# Altium project PONG.PrjPcb
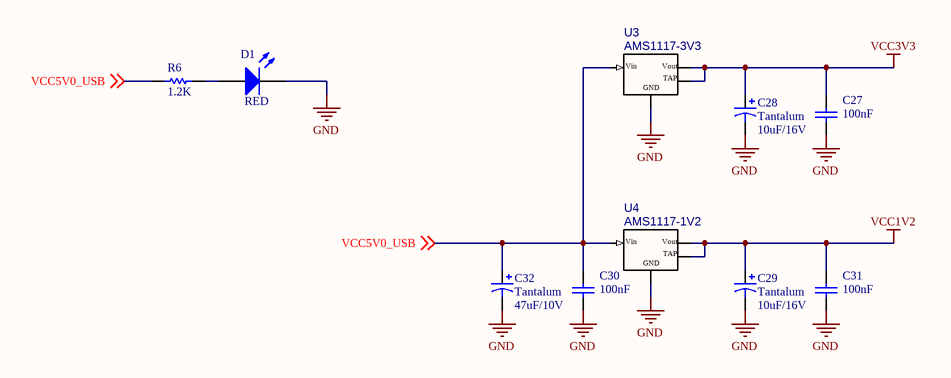
[diagram p0: s1.SchDoc]
3 sheets, 80 parts. Net scope: global (net labels, ports and power ports of the same name join across sheets).
Board file: pcb.PcbDoc
Sheets:
  s1.SchDoc
  s2.SchDoc
  s4.SchDoc

## Sheet s1.SchDoc
size A

### Parts
C27  value 100nF  [0805 CAP]  (hidden comment: Cap)
C28  Tantalum  value 10uF/16V  [CT1206_TANTALUM-SMD-10UF-20V-20%(1206)(Primary)]
C29  Tantalum  value 10uF/16V  [CT1206_TANTALUM-SMD-10UF-20V-20%(1206)(Primary)]
C30  value 100nF  [0805 CAP]  (hidden comment: Cap)
C31  value 100nF  [0805 CAP]  (hidden comment: Cap)
C32  Tantalum  value 47uF/10V  [CT1206_TANTALUM-SMD-10UF-20V-20%(1206)(Primary)]
D1  RED  [0805 LED]
R6  1.2K  [0805 RES]
U3  AMS1117-3V3  [AMS1117_AMS1117(Primary)]
U4  AMS1117-1V2  [AMS1117_AMS1117(Primary)]

### Nets
GND: C27.1 C28.2 C29.2 C30.1 C31.1 C32.2 D1.2(K) U3.GND(ADJ-GND) U4.GND(ADJ-GND)  [project net FPGA_M1]
VCC1V2: C29.1 C31.2 U4.HEATSINK U4.VOUT
VCC3V3: C27.2 C28.1 U3.HEATSINK U3.VOUT  [project net FPGA_M0]
VCC5V0_USB: C30.2 C32.1 R6.1 U3.VIN U4.VIN ; off-sheet VCC5V0_USB
NetD1_1: D1.1(A) R6.2

### Notes on the sheet
- (in symbol AMS1117) Vin; Vout; TAP

### Library data of the parts
C27 C30 C31 = Cap: Capacitor; Published: 8-Jun-2000; LatestRevisionDate: 17-Jul-2002; LatestRevisionNote: Re-released for DXP Platform.; PackageReference: RAD-0.3; Publisher: Altium Limited; PackageDescription: Radial Cap, Thru-Hole; 2 Leads; 0.3 in Pin Spacing
C28 C29 C32 = Cap Pol3: Polarized Capacitor (Surface Mount); Published: 8-Jun-2000; LatestRevisionDate: 29-May-2009; LatestRevisionNote: IPC-7351 Footprint Added.; PackageReference: C0805; Publisher: Altium Limited; PackageDescription: Chip Capacitor
D1 = LED0: Typical INFRARED GaAs LED; Published: 8-Jun-2000; LatestRevisionDate: 08-Jul-2005; LatestRevisionNote: Mech Layer 1 removed.; PackageReference: LED-0; Publisher: Altium Limited; PackageDescription: LED; 2 Leads
R6 = Res1: Resistor; Published: 8-Jun-2000; LatestRevisionDate: 17-Jul-2002; LatestRevisionNote: Re-released for DXP Platform.; PackageReference: AXIAL-0.3; Publisher: Altium Limited; PackageDescription: Axial Device, Thru-Hole; 2 Leads; 0.3 in Pin Spacing; Value: 1.2K
U3 U4 = AMS1117: Integrated Circuit; MF: Advanced Monolithic Systems; Package: UFQFN-24 Advanced Monolithic Systems; Availability: Unavailable; MP: AMS1117; Price: None; Value: *

## Sheet s2.SchDoc
size B
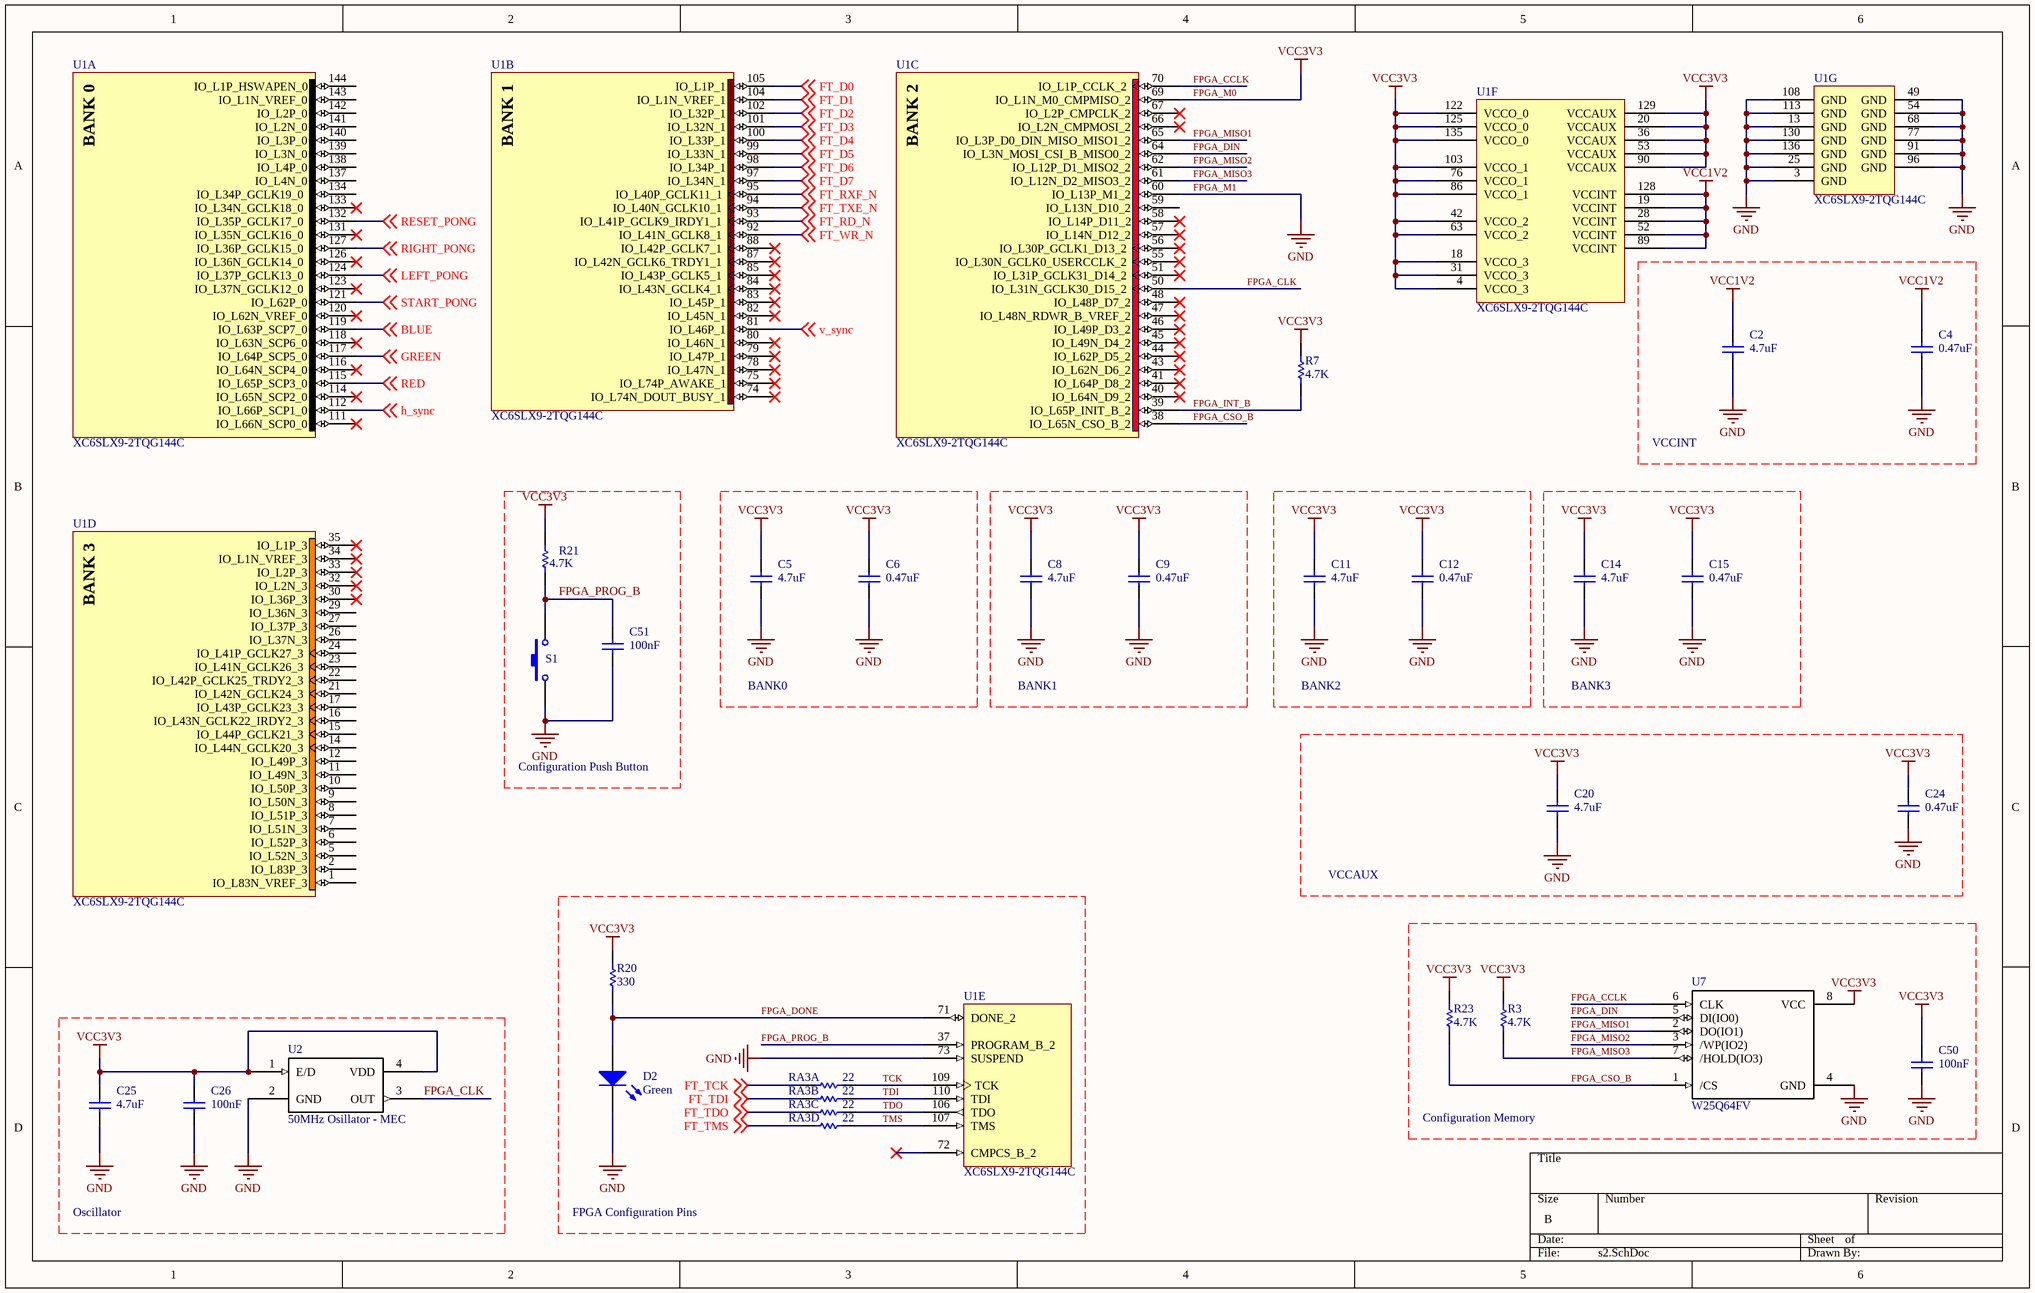
[diagram p1: s2.SchDoc]

### Parts
C2  value 4.7uF  [0805 CAP]  (hidden comment: Cap)
C4  value 0.47uF  [0805 CAP]  (hidden comment: Cap)
C5  value 4.7uF  [0805 CAP]  (hidden comment: Cap)
C6  value 0.47uF  [0805 CAP]  (hidden comment: Cap)
C8  value 4.7uF  [0805 CAP]  (hidden comment: Cap)
C9  value 0.47uF  [0805 CAP]  (hidden comment: Cap)
C11  value 4.7uF  [0805 CAP]  (hidden comment: Cap)
C12  value 0.47uF  [0805 CAP]  (hidden comment: Cap)
C14  value 4.7uF  [0805 CAP]  (hidden comment: Cap)
C15  value 0.47uF  [0805 CAP]  (hidden comment: Cap)
C20  value 4.7uF  [0805 CAP]  (hidden comment: Cap)
C24  value 0.47uF  [0805 CAP]  (hidden comment: Cap)
C25  value 4.7uF  [0805 CAP]  (hidden comment: Cap)
C26  value 100nF  [0805 CAP]  (hidden comment: Cap)
C50  value 100nF  [0805 CAP]  (hidden comment: Cap)
C51  value 100nF  [0805 CAP]  (hidden comment: Cap)
D2  Green  [0805 LED]
R3  value 4.7K  [0805 RES]  (hidden comment: Res1)
R7  value 4.7K  [0805 RES]  (hidden comment: Res1)
R20  value 330  [0805 RES]  (hidden comment: Res1)
R21  value 4.7K  [0805 RES]  (hidden comment: Res1)
R23  value 4.7K  [0805 RES]  (hidden comment: Res1)
RA3A  value 22  [0805 RES]  (hidden comment: Res1)
RA3B  value 22  [0805 RES]  (hidden comment: Res1)
RA3C  value 22  [0805 RES]  (hidden comment: Res1)
RA3D  value 22  [0805 RES]  (hidden comment: Res1)
S1  SW-PB  [Tack Switch]  (value not drawn)
U1  XC6SLX9-2TQG144C  [TQG144_M]  (parts A,B,C,D,E,F,G of 7)
U2  50MHz Osillator - MEC  [50MHz Osillator - MEC]
U7  W25Q64FV  [SO08 - duplicate]

### Nets
FPGA_M0: C5.2 C6.2 C8.2 C9.2 C11.2 C12.2 C14.2 C15.2 C20.2 C24.2 C25.2 C26.2 C50.2 R3.2 R7.2 R20.2 R21.2 R23.2 U1.4(VCCO_3) U1.18(VCCO_3) U1.20(VCCAUX) U1.31(VCCO_3) U1.36(VCCAUX) U1.42(VCCO_2) U1.53(VCCAUX) U1.63(VCCO_2) U1.69(IO_L1N_M0_CMPMISO_2) U1.76(VCCO_1) U1.86(VCCO_1) U1.90(VCCAUX) U1.103(VCCO_1) U1.122(VCCO_0) U1.125(VCCO_0) U1.129(VCCAUX) U1.135(VCCO_0) U2.1(E/D) U2.4(VDD) U7.8(VCC)  [also labelled VCC3V3]
FPGA_M1: C2.1 C4.1 C5.1 C6.1 C8.1 C9.1 C11.1 C12.1 C14.1 C15.1 C20.1 C24.1 C25.1 C26.1 C50.1 C51.1 D2.2(K) S1.1 U1.3(GND) U1.13(GND) U1.25(GND) U1.49(GND) U1.54(GND) U1.60(IO_L13P_M1_2) U1.68(GND) U1.73(SUSPEND) U1.77(GND) U1.91(GND) U1.96(GND) U1.108(GND) U1.113(GND) U1.130(GND) U1.136(GND) U2.2(GND) U7.4(GND)  [also labelled GND]
VCC1V2: C2.2 C4.2 U1.19(VCCINT) U1.28(VCCINT) U1.52(VCCINT) U1.89(VCCINT) U1.128(VCCINT)
BLUE: U1.119(IO_L63P_SCP7_0) ; off-sheet BLUE
FPGA_CCLK: U1.70(IO_L1P_CCLK_2) U7.6(CLK)
FPGA_CLK: U1.50(IO_L31N_GCLK30_D15_2) U2.3(OUT)
FPGA_CSO_B: R23.1 U1.38(IO_L65N_CSO_B_2) U7.1(/CS)
FPGA_DIN: U1.64(IO_L3N_MOSI_CSI_B_MISO0_2) U7.5(DI(IO0))
FPGA_DONE: D2.1(A) R20.1 U1.71(DONE_2)
FPGA_INT_B: R7.1 U1.39(IO_L65P_INIT_B_2)
FPGA_MISO1: U1.65(IO_L3P_D0_DIN_MISO_MISO1_2) U7.2(DO(IO1))
FPGA_MISO2: U1.62(IO_L12P_D1_MISO2_2) U7.3(/WP(IO2))
FPGA_MISO3: R3.1 U1.61(IO_L12N_D2_MISO3_2) U7.7(/HOLD(IO3))
FPGA_PROG_B: C51.2 R21.1 S1.2 U1.37(PROGRAM_B_2)
FT_D0: U1.105(IO_L1P_1) ; off-sheet FT_D0
FT_D1: U1.104(IO_L1N_VREF_1) ; off-sheet FT_D1
FT_D2: U1.102(IO_L32P_1) ; off-sheet FT_D2
FT_D3: U1.101(IO_L32N_1) ; off-sheet FT_D3
FT_D4: U1.100(IO_L33P_1) ; off-sheet FT_D4
FT_D5: U1.99(IO_L33N_1) ; off-sheet FT_D5
FT_D6: U1.98(IO_L34P_1) ; off-sheet FT_D6
FT_D7: U1.97(IO_L34N_1) ; off-sheet FT_D7
FT_RD_N: U1.93(IO_L41P_GCLK9_IRDY1_1) ; off-sheet FT_RD_N
FT_RXF_N: U1.95(IO_L40P_GCLK11_1) ; off-sheet FT_RXF_N
FT_TCK: RA3A.2 ; off-sheet FT_TCK
FT_TDI: RA3B.2 ; off-sheet FT_TDI
FT_TDO: RA3C.2 ; off-sheet FT_TDO
FT_TMS: RA3D.2 ; off-sheet FT_TMS
FT_TXE_N: U1.94(IO_L40N_GCLK10_1) ; off-sheet FT_TXE_N
FT_WR_N: U1.92(IO_L41N_GCLK8_1) ; off-sheet FT_WR_N
GREEN: U1.117(IO_L64P_SCP5_0) ; off-sheet GREEN
h_sync: U1.112(IO_L66P_SCP1_0) ; off-sheet h_sync
LEFT_PONG: U1.124(IO_L37P_GCLK13_0) ; off-sheet LEFT_PONG
RED: U1.115(IO_L65P_SCP3_0) ; off-sheet RED
RESET_PONG: U1.132(IO_L35P_GCLK17_0) ; off-sheet RESET_PONG
RIGHT_PONG: U1.127(IO_L36P_GCLK15_0) ; off-sheet RIGHT_PONG
START_PONG: U1.121(IO_L62P_0) ; off-sheet START_PONG
TCK: RA3A.1 U1.109(TCK)
TDI: RA3B.1 U1.110(TDI)
TDO: RA3C.1 U1.106(TDO)
TMS: RA3D.1 U1.107(TMS)
v_sync: U1.81(IO_L46P_1) ; off-sheet v_sync

Not connected (* = marked no-connect by the designer): U1 1(IO_L83N_VREF_3) 2(IO_L83P_3) 5(IO_L52N_3) 6(IO_L52P_3) 7(IO_L51N_3) 8(IO_L51P_3) 9(IO_L50N_3) 10(IO_L50P_3) 11(IO_L49N_3) 12(IO_L49P_3) 14(IO_L44N_GCLK20_3) 15(IO_L44P_GCLK21_3) 16(IO_L43N_GCLK22_IRDY2_3) 17(IO_L43P_GCLK23_3) 21(IO_L42N_GCLK24_3) 22(IO_L42P_GCLK25_TRDY2_3) 23(IO_L41N_GCLK26_3) 24(IO_L41P_GCLK27_3) 26(IO_L37N_3) 27(IO_L37P_3) 29(IO_L36N_3) 30(IO_L36P_3)* 32(IO_L2N_3)* 33(IO_L2P_3)* 34(IO_L1N_VREF_3)* 35(IO_L1P_3)* 40(IO_L64N_D9_2)* 41(IO_L64P_D8_2)* 43(IO_L62N_D6_2)* 44(IO_L62P_D5_2)* 45(IO_L49N_D4_2)* 46(IO_L49P_D3_2)* 47(IO_L48N_RDWR_B_VREF_2)* 48(IO_L48P_D7_2)* 51(IO_L31P_GCLK31_D14_2)* 55(IO_L30N_GCLK0_USERCCLK_2)* 56(IO_L30P_GCLK1_D13_2)* 57(IO_L14N_D12_2)* 58(IO_L14P_D11_2)* 59(IO_L13N_D10_2) 66(IO_L2N_CMPMOSI_2)* 67(IO_L2P_CMPCLK_2)* 72(CMPCS_B_2)* 74(IO_L74N_DOUT_BUSY_1)* 75(IO_L74P_AWAKE_1)* 78(IO_L47N_1)* 79(IO_L47P_1)* 80(IO_L46N_1)* 82(IO_L45N_1)* 83(IO_L45P_1)* 84(IO_L43N_GCLK4_1)* 85(IO_L43P_GCLK5_1)* 87(IO_L42N_GCLK6_TRDY1_1)* 88(IO_L42P_GCLK7_1)* 111(IO_L66N_SCP0_0)* 114(IO_L65N_SCP2_0)* 116(IO_L64N_SCP4_0)* 118(IO_L63N_SCP6_0)* 120(IO_L62N_VREF_0)* 123(IO_L37N_GCLK12_0)* 126(IO_L36N_GCLK14_0)* 131(IO_L35N_GCLK16_0)* 133(IO_L34N_GCLK18_0)* 134(IO_L34P_GCLK19_0) 137(IO_L4N_0) 138(IO_L4P_0) 139(IO_L3N_0) 140(IO_L3P_0) 141(IO_L2N_0) 142(IO_L2P_0) 143(IO_L1N_VREF_0) 144(IO_L1P_HSWAPEN_0)

### Notes on the sheet
- VCCINT
- BANK0
- BANK1
- BANK2
- BANK3
- Configuration Push Button
- VCCAUX
- Configuration Memory
- Oscillator
- FPGA Configuration Pins
- (in symbol XC6SLX9-2TQG144C, part A) BANK 0
- (in symbol XC6SLX9-2TQG144C, part B) BANK 1
- (in symbol XC6SLX9-2TQG144C, part C) BANK 2
- (in symbol XC6SLX9-2TQG144C, part D) BANK 3

### Library data of the parts
C2 C4-C6 C8 C9 C11 C12 C14 C15 C20 C24-C26 C50 C51 = Cap: Capacitor; Published: 8-Jun-2000; LatestRevisionDate: 17-Jul-2002; LatestRevisionNote: Re-released for DXP Platform.; PackageReference: RAD-0.3; Publisher: Altium Limited; PackageDescription: Radial Cap, Thru-Hole; 2 Leads; 0.3 in Pin Spacing
D2 = LED0: Typical INFRARED GaAs LED; Published: 8-Jun-2000; LatestRevisionDate: 08-Jul-2005; LatestRevisionNote: Mech Layer 1 removed.; PackageReference: LED-0; Publisher: Altium Limited; PackageDescription: LED; 2 Leads
R3 R7 R20 R21 R23 RA3A RA3B RA3C RA3D = Res1: Resistor; Published: 8-Jun-2000; LatestRevisionDate: 17-Jul-2002; LatestRevisionNote: Re-released for DXP Platform.; PackageReference: AXIAL-0.3; Publisher: Altium Limited; PackageDescription: Axial Device, Thru-Hole; 2 Leads; 0.3 in Pin Spacing
S1 = SW-PB: Switch; pin to pad: 2>3; Published: 24-Mar-1999; LatestRevisionDate: 17-Jul-2002; LatestRevisionNote: Re-released for DXP Platform.; PackageReference: SPST-2; Publisher: Altium Limited; PackageDescription: Switch; 2 Leads
U1 = XC6SLX9-2TQG144C: Spartan-6 LX 1.2V FPGA, 102 User I/Os, 144-Pin TQFP (0.5mm Pitch), Speed Grade 2, Commercial Grade, Pb-Free; DatasheetVersion: ver1.6, Nov-2010; PackageVersion: ver1.2, Jun-2004; PackageReference: TQG144; PackageDescription: 144-Pin Thin Quad Flat Pack (TQG144) - Pb-Free; Code_JEDEC: MS-026-BFB; ComponentLink1Description: Manufacturer URL; ComponentLink1URL: http://www.xilinx.com/; ComponentLink2Description: Spartan-6 Datasheet; ComponentLink2URL: http://www.xilinx.com/support/documentation/data_sheets/ds160.pdf; ComponentLink3Description: Spartan-6 Documents; ComponentLink3URL: http://www.xilinx.com/support/documentation/spartan-6.htm

## Sheet s4.SchDoc
size B
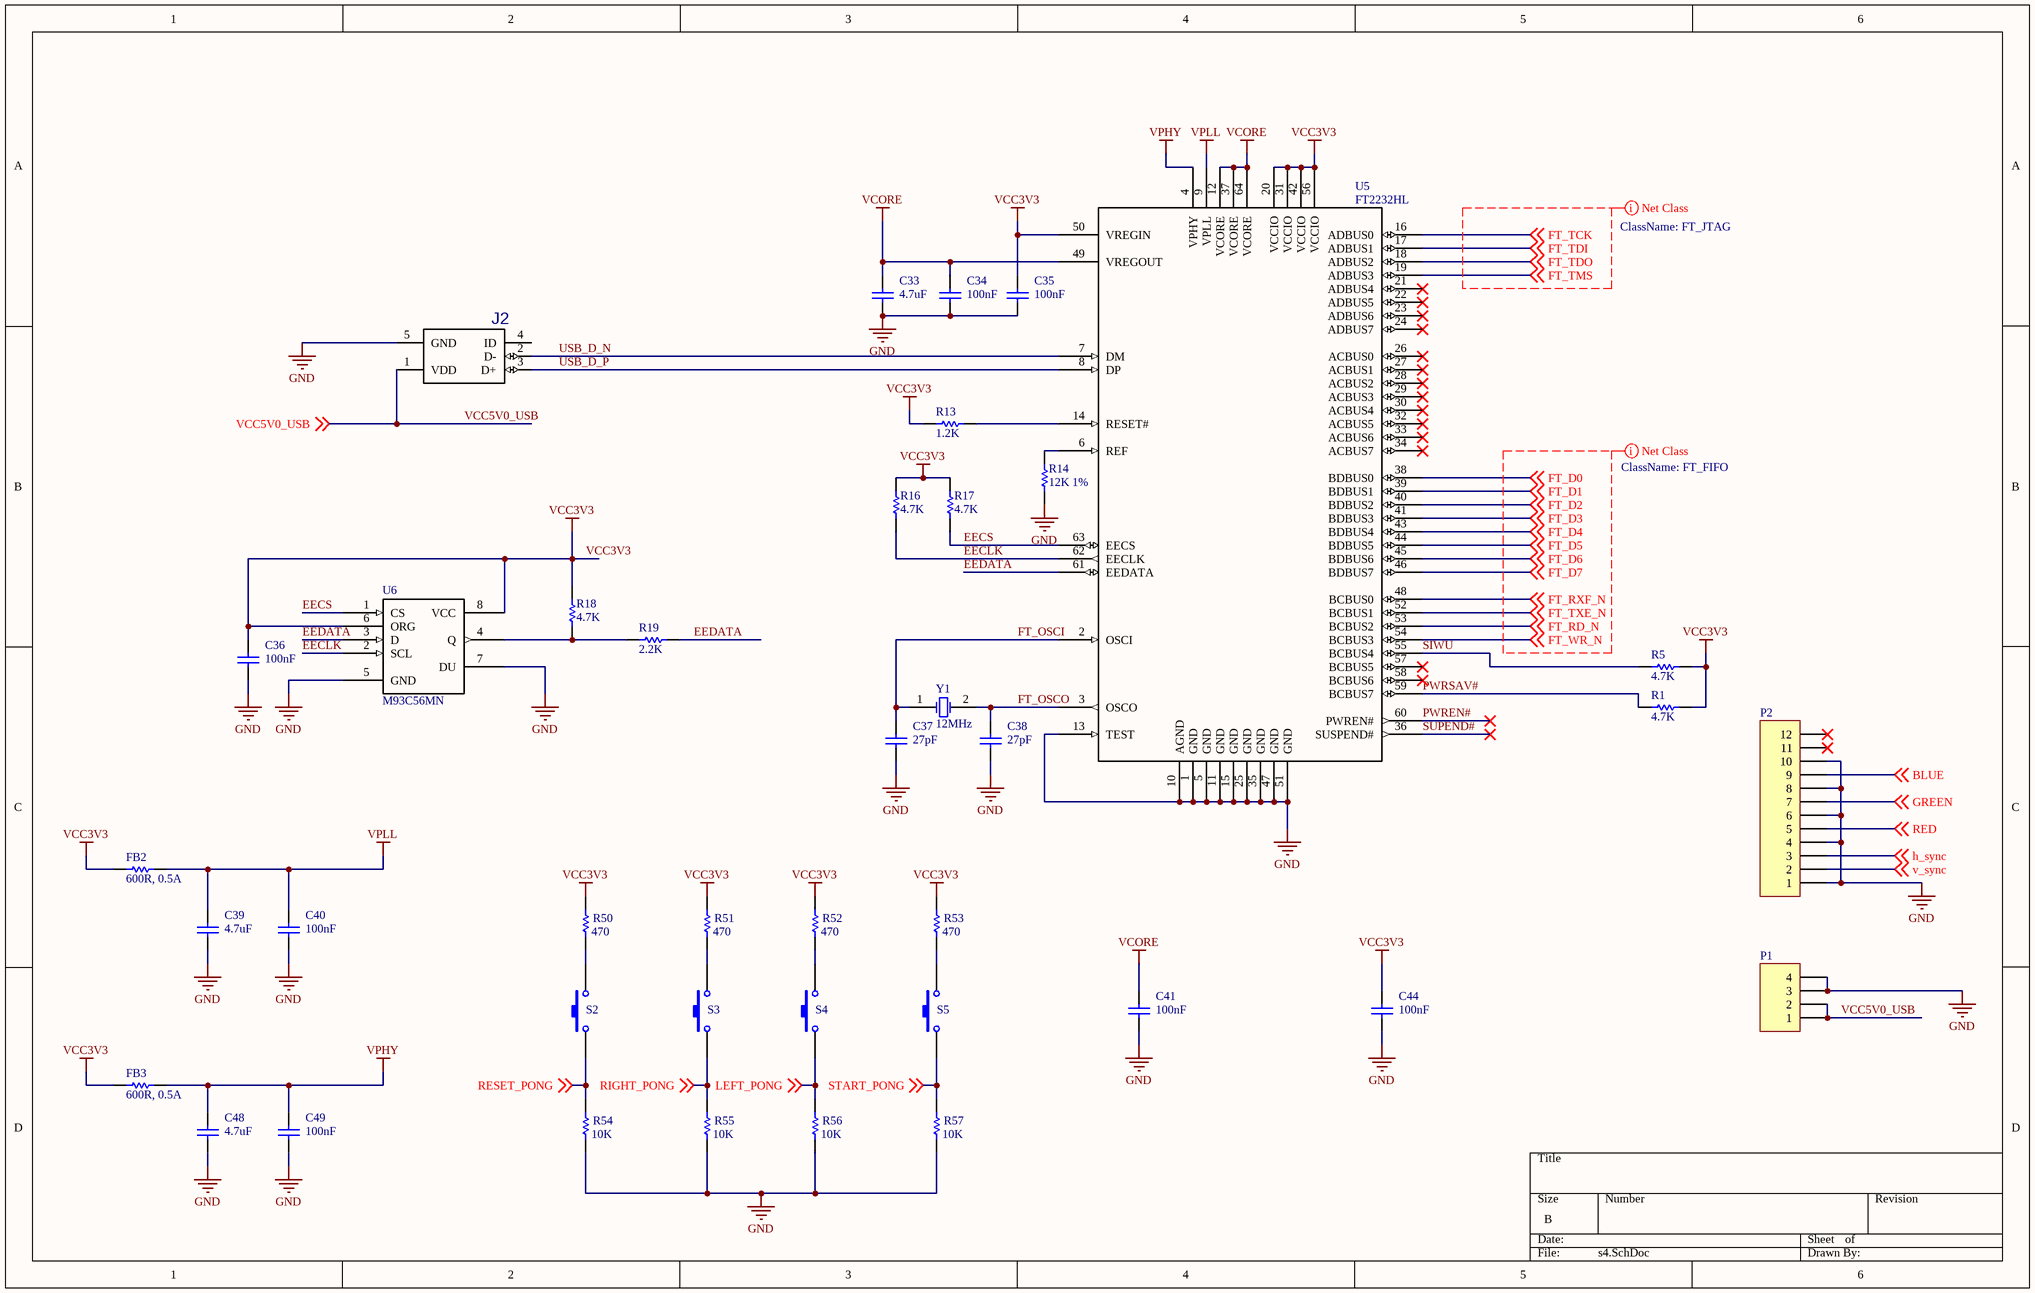
[diagram p2: s4.SchDoc]

### Parts
C33  value 4.7uF  [0805 CAP]  (hidden comment: Cap)
C34  value 100nF  [0805 CAP]  (hidden comment: Cap)
C35  value 100nF  [0805 CAP]  (hidden comment: Cap)
C36  value 100nF  [0805 CAP]  (hidden comment: 27pF)
C37  27pF  [0805 CAP]
C38  value 27pF  [0805 CAP]  (hidden comment: Cap)
C39  value 4.7uF  [0805 CAP]  (hidden comment: 27pF)
C40  value 100nF  [0805 CAP]  (hidden comment: 27pF)
C41  value 100nF  [0805 CAP]  (hidden comment: Cap)
C44  value 100nF  [0805 CAP]  (hidden comment: Cap)
C48  value 4.7uF  [0805 CAP]  (hidden comment: 27pF)
C49  value 100nF  [0805 CAP]  (hidden comment: 27pF)
FB2  value 600R, 0.5A  [0805 RES]  (hidden comment: Res1)
FB3  value 600R, 0.5A  [0805 RES]  (hidden comment: Res1)
J2  105017-0001  [MOLEX_105017-0001]  (value not drawn)
P1  MHDR1X4  [4 PIN]  (value not drawn)
P2  MHDR1X12  [12 PIN]  (value not drawn)
R1  value 4.7K  [0805 RES]  (hidden comment: Res1)
R5  value 4.7K  [0805 RES]  (hidden comment: Res1)
R13  value 1.2K  [0805 RES]  (hidden comment: Res1)
R14  value 12K 1%  [0805 RES]  (hidden comment: Res1)
R16  value 4.7K  [0805 RES]  (hidden comment: Res1)
R17  value 4.7K  [0805 RES]  (hidden comment: Res1)
R18  value 4.7K  [0805 RES]  (hidden comment: Res1)
R19  value 2.2K  [0805 RES]  (hidden comment: Res1)
R50  value 470  [0805 RES]  (hidden comment: Res1)
R51  value 470  [0805 RES]  (hidden comment: Res1)
R52  value 470  [0805 RES]  (hidden comment: Res1)
R53  value 470  [0805 RES]  (hidden comment: Res1)
R54  value 10K  [0805 RES]  (hidden comment: Res1)
R55  value 10K  [0805 RES]  (hidden comment: Res1)
R56  value 10K  [0805 RES]  (hidden comment: Res1)
R57  value 10K  [0805 RES]  (hidden comment: Res1)
S2  SW-PB  [Tack Switch]  (value not drawn)
S3  SW-PB  [Tack Switch]  (value not drawn)
S4  SW-PB  [Tack Switch]  (value not drawn)
S5  SW-PB  [Tack Switch]  (value not drawn)
U5  FT2232HL  [LQFP64]
U6  M93C56MN  [SOIC127P600X175-8N]
Y1  12MHz  [XTAL1170X500X450]

### Nets
GND: C33.1 C34.1 C35.1 C36.1 C37.1 C38.1 C39.1 C40.1 C41.1 C44.1 C48.1 C49.1 J2.5(GND) P1.3 P1.4 P2.1 P2.4 P2.6 P2.8 P2.10 R14.2 R54.1 R55.1 R56.1 R57.1 U5.1(GND) U5.5(GND) U5.10(AGND) U5.11(GND) U5.13(TEST) U5.15(GND) U5.25(GND) U5.35(GND) U5.47(GND) U5.51(GND) U6.5(GND) U6.7(DU)  [project net FPGA_M1]
VCC3V3: C35.2 C36.2 C44.2 FB2.2 FB3.2 R1.1 R5.1 R13.2 R16.1 R17.1 R18.1 R50.2 R51.2 R52.2 R53.2 U5.20(VCCIO) U5.31(VCCIO) U5.42(VCCIO) U5.50(VREGIN) U5.56(VCCIO) U6.6(ORG) U6.8(VCC)  [project net FPGA_M0]
VCORE: C33.2 C34.2 C41.2 U5.12(VCORE) U5.37(VCORE) U5.49(VREGOUT) U5.64(VCORE)
VPHY: C48.2 C49.2 FB3.1 U5.4(VPHY)
VPLL: C39.2 C40.2 FB2.1 U5.9(VPLL)
BLUE: P2.9 ; off-sheet BLUE
EECLK: R16.2 U5.62(EECLK) U6.2(SCL)
EECS: R17.2 U5.63(EECS) U6.1(CS)
EEDATA: R19.2 U5.61(EEDATA) U6.3(D)
FT_D0: U5.38(BDBUS0) ; off-sheet FT_D0
FT_D1: U5.39(BDBUS1) ; off-sheet FT_D1
FT_D2: U5.40(BDBUS2) ; off-sheet FT_D2
FT_D3: U5.41(BDBUS3) ; off-sheet FT_D3
FT_D4: U5.43(BDBUS4) ; off-sheet FT_D4
FT_D5: U5.44(BDBUS5) ; off-sheet FT_D5
FT_D6: U5.45(BDBUS6) ; off-sheet FT_D6
FT_D7: U5.46(BDBUS7) ; off-sheet FT_D7
FT_OSCI: C37.2 U5.2(OSCI) Y1.1(OSC1)
FT_OSCO: C38.2 U5.3(OSCO) Y1.2(OSC2)
FT_RD_N: U5.53(BCBUS2) ; off-sheet FT_RD_N
FT_RXF_N: U5.48(BCBUS0) ; off-sheet FT_RXF_N
FT_TCK: U5.16(ADBUS0) ; off-sheet FT_TCK
FT_TDI: U5.17(ADBUS1) ; off-sheet FT_TDI
FT_TDO: U5.18(ADBUS2) ; off-sheet FT_TDO
FT_TMS: U5.19(ADBUS3) ; off-sheet FT_TMS
FT_TXE_N: U5.52(BCBUS1) ; off-sheet FT_TXE_N
FT_WR_N: U5.54(BCBUS3) ; off-sheet FT_WR_N
GREEN: P2.7 ; off-sheet GREEN
h_sync: P2.3 ; off-sheet h_sync
LEFT_PONG: R56.2 S4.1 ; off-sheet LEFT_PONG
PWREN#: U5.60(PWREN#)
PWRSAV#: R1.2 U5.59(BCBUS7)
RED: P2.5 ; off-sheet RED
RESET_PONG: R54.2 S2.1 ; off-sheet RESET_PONG
RIGHT_PONG: R55.2 S3.1 ; off-sheet RIGHT_PONG
SIWU: R5.2 U5.55(BCBUS4)
START_PONG: R57.2 S5.1 ; off-sheet START_PONG
SUPEND#: U5.36(SUSPEND#)
USB_D_N: J2.2(D-) U5.7(DM)
USB_D_P: J2.3(D+) U5.8(DP)
v_sync: P2.2 ; off-sheet v_sync
VCC5V0_USB: J2.1(VDD) P1.1 P1.2 ; off-sheet VCC5V0_USB
NetR13_1: R13.1 U5.14(RESET#)
NetR14_1: R14.1 U5.6(REF)
NetR18_2: R18.2 R19.1 U6.4(Q)
NetR50_1: R50.1 S2.2
NetR51_1: R51.1 S3.2
NetR52_1: R52.1 S4.2
NetR53_1: R53.1 S5.2

Not connected (* = marked no-connect by the designer): J2 4(ID); P2 11* 12*; U5 21(ADBUS4)* 22(ADBUS5)* 23(ADBUS6)* 24(ADBUS7)* 26(ACBUS0)* 27(ACBUS1)* 28(ACBUS2)* 29(ACBUS3)* 30(ACBUS4)* 32(ACBUS5)* 33(ACBUS6)* 34(ACBUS7)* 57(BCBUS5)* 58(BCBUS6)*

### Layout directives
net class FT_JTAG: FT_TCK, FT_TDI, FT_TDO, FT_TMS
net class FT_FIFO: FT_D0, FT_D1, FT_D2, FT_D3, FT_D4, FT_D5, FT_D6, FT_D7, FT_RD_N, FT_RXF_N, FT_TXE_N, FT_WR_N

### Library data of the parts
C33-C41 C44 C48 C49 = Cap: Capacitor; Published: 8-Jun-2000; LatestRevisionDate: 17-Jul-2002; LatestRevisionNote: Re-released for DXP Platform.; PackageReference: RAD-0.3; Publisher: Altium Limited; PackageDescription: Radial Cap, Thru-Hole; 2 Leads; 0.3 in Pin Spacing
  C37: Value: 27pF
FB2 FB3 R1 R5 R13 R14 R16-R19 R50-R57 = Res1: Resistor; Published: 8-Jun-2000; LatestRevisionDate: 17-Jul-2002; LatestRevisionNote: Re-released for DXP Platform.; PackageReference: AXIAL-0.3; Publisher: Altium Limited; PackageDescription: Axial Device, Thru-Hole; 2 Leads; 0.3 in Pin Spacing
J2 = 105017-0001: Conn USB Type B M 5 POS 0.65mm Solder RA Thru-Hole 5 Terminal 1 Port Embossed T/R; MF: Molex; Price: 0.47 USD; Availability: Good; Package: None; MP: 105017-0001; Value: *
P1 = MHDR1X4: Header, 4-Pin; LatestRevisionDate: 17-Jul-2002; LatestRevisionNote: Re-released for DXP Platform.; Publisher: Altium Limited
P2 = MHDR1X12: Header, 12-Pin; LatestRevisionDate: 17-Jul-2002; LatestRevisionNote: Re-released for DXP Platform.; Publisher: Altium Limited
S2-S5 = SW-PB: Switch; pin to pad: 2>3; Published: 24-Mar-1999; LatestRevisionDate: 17-Jul-2002; LatestRevisionNote: Re-released for DXP Platform.; PackageReference: SPST-2; Publisher: Altium Limited; PackageDescription: Switch; 2 Leads
Y1 = XTAL: Crystal Oscillator; Published: 8-Jun-2000; LatestRevisionDate: 17-Jul-2002; LatestRevisionNote: Re-released for DXP Platform.; PackageReference: R38; Publisher: Altium Limited; PackageDescription: Crystal, Thru-Hole; 2 Leads; Body 3.1 x 8.2 mm (Dia.xH)

## Nets that join several sheets
FPGA_M0: s1 (C27.2 C28.1 U3.HEATSINK U3.VOUT), s2 (38 pins), s4 (22 pins)
FPGA_M1: s1 (9 pins), s2 (35 pins), s4 (37 pins)
VCC1V2: s1 (C29.1 C31.2 U4.HEATSINK U4.VOUT), s2 (7 pins)
BLUE: s2 (U1.119), s4 (P2.9)
FT_D0: s2 (U1.105), s4 (U5.38)
FT_D1: s2 (U1.104), s4 (U5.39)
FT_D2: s2 (U1.102), s4 (U5.40)
FT_D3: s2 (U1.101), s4 (U5.41)
FT_D4: s2 (U1.100), s4 (U5.43)
FT_D5: s2 (U1.99), s4 (U5.44)
FT_D6: s2 (U1.98), s4 (U5.45)
FT_D7: s2 (U1.97), s4 (U5.46)
FT_RD_N: s2 (U1.93), s4 (U5.53)
FT_RXF_N: s2 (U1.95), s4 (U5.48)
FT_TCK: s2 (RA3A.2), s4 (U5.16)
FT_TDI: s2 (RA3B.2), s4 (U5.17)
FT_TDO: s2 (RA3C.2), s4 (U5.18)
FT_TMS: s2 (RA3D.2), s4 (U5.19)
FT_TXE_N: s2 (U1.94), s4 (U5.52)
FT_WR_N: s2 (U1.92), s4 (U5.54)
GREEN: s2 (U1.117), s4 (P2.7)
h_sync: s2 (U1.112), s4 (P2.3)
LEFT_PONG: s2 (U1.124), s4 (R56.2 S4.1)
RED: s2 (U1.115), s4 (P2.5)
RESET_PONG: s2 (U1.132), s4 (R54.2 S2.1)
RIGHT_PONG: s2 (U1.127), s4 (R55.2 S3.1)
START_PONG: s2 (U1.121), s4 (R57.2 S5.1)
v_sync: s2 (U1.81), s4 (P2.2)
VCC5V0_USB: s1 (5 pins), s4 (J2.1 P1.1 P1.2)